# Altium schematic sheet MCU.SchDoc
size A4; SheetNumber: 2; SheetTotal: 10
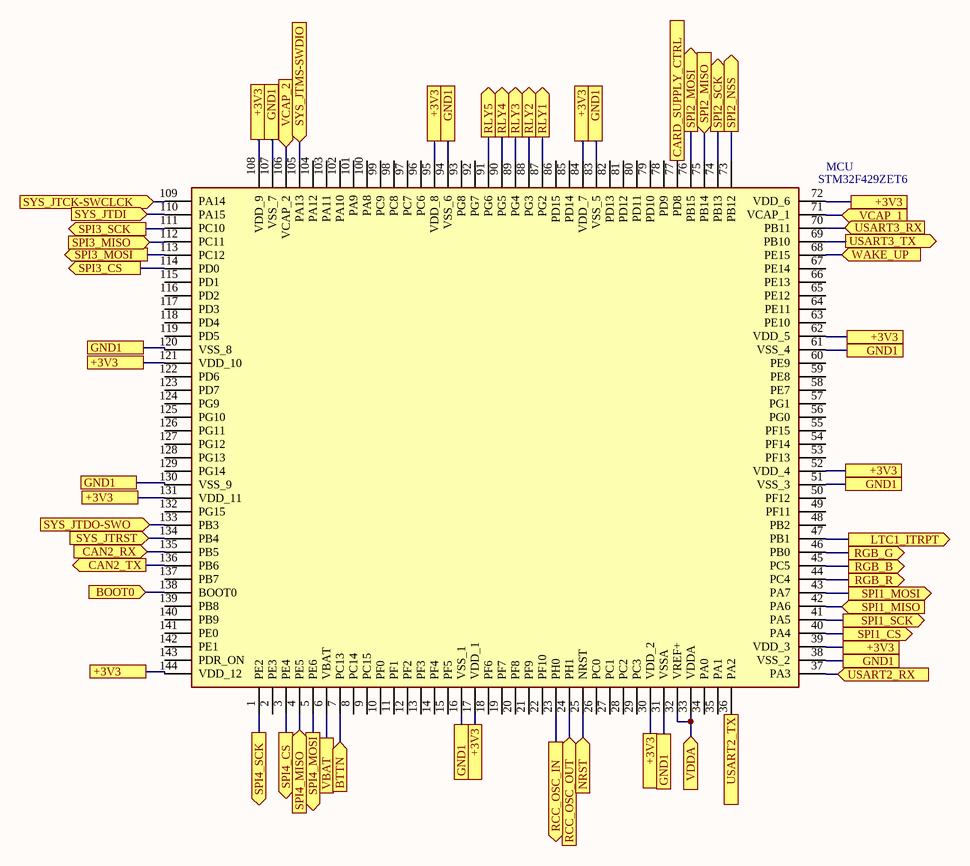
[diagram p0: MCU.SchDoc]

## Parts
MCU  STM32F429ZET6  [QFP50P2200X2200X160-144N]

## Ports
+3V3, BOOT0 (in), BTTN (in), CAN2_RX (in), CAN2_TX (out), CARD_SUPPLY_CTRL (out), GND1, LTC1_ITRPT (out), NRST (in), RCC_OSC_IN (out), RCC_OSC_OUT (in), RGB_B (out), RGB_G (out), RGB_R (out), RLY1 (out), RLY2 (out), RLY3 (out), RLY4 (out), RLY5 (out), SPI1_CS (out), SPI1_MISO (in), SPI1_MOSI (out), SPI1_SCK (out), SPI2_MISO (in), SPI2_MOSI (out), SPI2_NSS (out), SPI2_SCK (out), SPI3_CS (out), SPI3_MISO (in), SPI3_MOSI (out), SPI3_SCK (out), SPI4_CS (out), SPI4_MISO (in), SPI4_MOSI (out), SPI4_SCK (out), SYS_JTCK-SWCLCK (in), SYS_JTDI (in), SYS_JTDO-SWO (in), SYS_JTMS-SWDIO (in), SYS_JTRST (in), USART2_RX (in), USART2_TX (out), USART3_RX (in), USART3_TX (out), VBAT, VCAP_1 (in), VCAP_2 (in), VDDA (in), WAKE_UP (in)

## Nets
+3V3: MCU.17(VDD_1) MCU.30(VDD_2) MCU.39(VDD_3) MCU.52(VDD_4) MCU.62(VDD_5) MCU.72(VDD_6) MCU.84(VDD_7) MCU.95(VDD_8) MCU.108(VDD_9) MCU.121(VDD_10) MCU.131(VDD_11) MCU.144(VDD_12) ; port +3V3
BOOT0: MCU.138(BOOT0) ; port BOOT0
BTTN: MCU.7(PC13) ; port BTTN
CAN2_RX: MCU.135(PB5) ; port CAN2_RX
CAN2_TX: MCU.136(PB6) ; port CAN2_TX
CARD_SUPPLY_CTRL: MCU.77(PD8) ; port CARD_SUPPLY_CTRL
GND1: MCU.16(VSS_1) MCU.31(VSSA) MCU.38(VSS_2) MCU.51(VSS_3) MCU.61(VSS_4) MCU.83(VSS_5) MCU.94(VSS_6) MCU.107(VSS_7) MCU.120(VSS_8) MCU.130(VSS_9) ; port GND1
LTC1_ITRPT: MCU.47(PB1) ; port LTC1_ITRPT
NRST: MCU.25(NRST) ; port NRST
RCC_OSC_IN: MCU.23(PH0) ; port RCC_OSC_IN
RCC_OSC_OUT: MCU.24(PH1) ; port RCC_OSC_OUT
RGB_B: MCU.45(PC5) ; port RGB_B
RGB_G: MCU.46(PB0) ; port RGB_G
RGB_R: MCU.44(PC4) ; port RGB_R
RLY1: MCU.87(PG2) ; port RLY1
RLY2: MCU.88(PG3) ; port RLY2
RLY3: MCU.89(PG4) ; port RLY3
RLY4: MCU.90(PG5) ; port RLY4
RLY5: MCU.91(PG6) ; port RLY5
SPI1_CS: MCU.40(PA4) ; port SPI1_CS
SPI1_MISO: MCU.42(PA6) ; port SPI1_MISO
SPI1_MOSI: MCU.43(PA7) ; port SPI1_MOSI
SPI1_SCK: MCU.41(PA5) ; port SPI1_SCK
SPI2_MISO: MCU.75(PB14) ; port SPI2_MISO
SPI2_MOSI: MCU.76(PB15) ; port SPI2_MOSI
SPI2_NSS: MCU.73(PB12) ; port SPI2_NSS
SPI2_SCK: MCU.74(PB13) ; port SPI2_SCK
SPI3_CS: MCU.114(PD0) ; port SPI3_CS
SPI3_MISO: MCU.112(PC11) ; port SPI3_MISO
SPI3_MOSI: MCU.113(PC12) ; port SPI3_MOSI
SPI3_SCK: MCU.111(PC10) ; port SPI3_SCK
SPI4_CS: MCU.3(PE4) ; port SPI4_CS
SPI4_MISO: MCU.4(PE5) ; port SPI4_MISO
SPI4_MOSI: MCU.5(PE6) ; port SPI4_MOSI
SPI4_SCK: MCU.1(PE2) ; port SPI4_SCK
SYS_JTCK-SWCLCK: MCU.109(PA14) ; port SYS_JTCK-SWCLCK
SYS_JTDI: MCU.110(PA15) ; port SYS_JTDI
SYS_JTDO-SWO: MCU.133(PB3) ; port SYS_JTDO-SWO
SYS_JTMS-SWDIO: MCU.105(PA13) ; port SYS_JTMS-SWDIO
SYS_JTRST: MCU.134(PB4) ; port SYS_JTRST
USART2_RX: MCU.37(PA3) ; port USART2_RX
USART2_TX: MCU.36(PA2) ; port USART2_TX
USART3_RX: MCU.70(PB11) ; port USART3_RX
USART3_TX: MCU.69(PB10) ; port USART3_TX
VBAT: MCU.6(VBAT) ; port VBAT
VCAP_1: MCU.71(VCAP_1) ; port VCAP_1
VCAP_2: MCU.106(VCAP_2) ; port VCAP_2
VDDA: MCU.32(VREF+) MCU.33(VDDA) ; port VDDA
WAKE_UP: MCU.68(PE15) ; port WAKE_UP

Not connected (* = marked no-connect by the designer): MCU 2(PE3) 8(PC14) 9(PC15) 10(PF0) 11(PF1) 12(PF2) 13(PF3) 14(PF4) 15(PF5) 18(PF6) 19(PF7) 20(PF8) 21(PF9) 22(PF10) 26(PC0) 27(PC1) 28(PC2) 29(PC3) 34(PA0) 35(PA1) 48(PB2) 49(PF11) 50(PF12) 53(PF13) 54(PF14) 55(PF15) 56(PG0) 57(PG1) 58(PE7) 59(PE8) 60(PE9) 63(PE10) 64(PE11) 65(PE12) 66(PE13) 67(PE14) 78(PD9) 79(PD10) 80(PD11) 81(PD12) 82(PD13) 85(PD14) 86(PD15) 92(PG7) 93(PG8) 96(PC6) 97(PC7) 98(PC8) 99(PC9) 100(PA8) 101(PA9) 102(PA10) 103(PA11) 104(PA12) 115(PD1) 116(PD2) 117(PD3) 118(PD4) 119(PD5) 122(PD6) 123(PD7) 124(PG9) 125(PG10) 126(PG11) 127(PG12) 128(PG13) 129(PG14) 132(PG15) 137(PB7) 139(PB8) 140(PB9) 141(PE0) 142(PE1) 143(PDR_ON)

## Library data of the parts
MCU = STM32F429ZET6: Integrated Circuit; Manufacturer_Name: STMicroelectronics; Datasheet Link: https://4donline.ihs.com/images/VipMasterIC/IC/SGST/SGST-S-A0001417754/SGST-S-A0001417754-1.pdf?hkey=6D3A4C79FDBF58556ACFDE234799DDF0; Height: 1.6mm; Manufacturer_Part_Number: STM32F429ZET6; Mouser Part Number: 511-STM32F429ZET6; Mouser Price/Stock: https://www.mouser.co.uk/ProductDetail/STMicroelectronics/STM32F429ZET6/?qs=9MuLHSklicp1Z3GRN0zw1w%3D%3D; Arrow Part Number: STM32F429ZET6; Arrow Price/Stock: https://www.arrow.com/en/products/stm32f429zet6/stmicroelectronics